# EAGLE design knowles_mic (EAGLE 7.2.0)
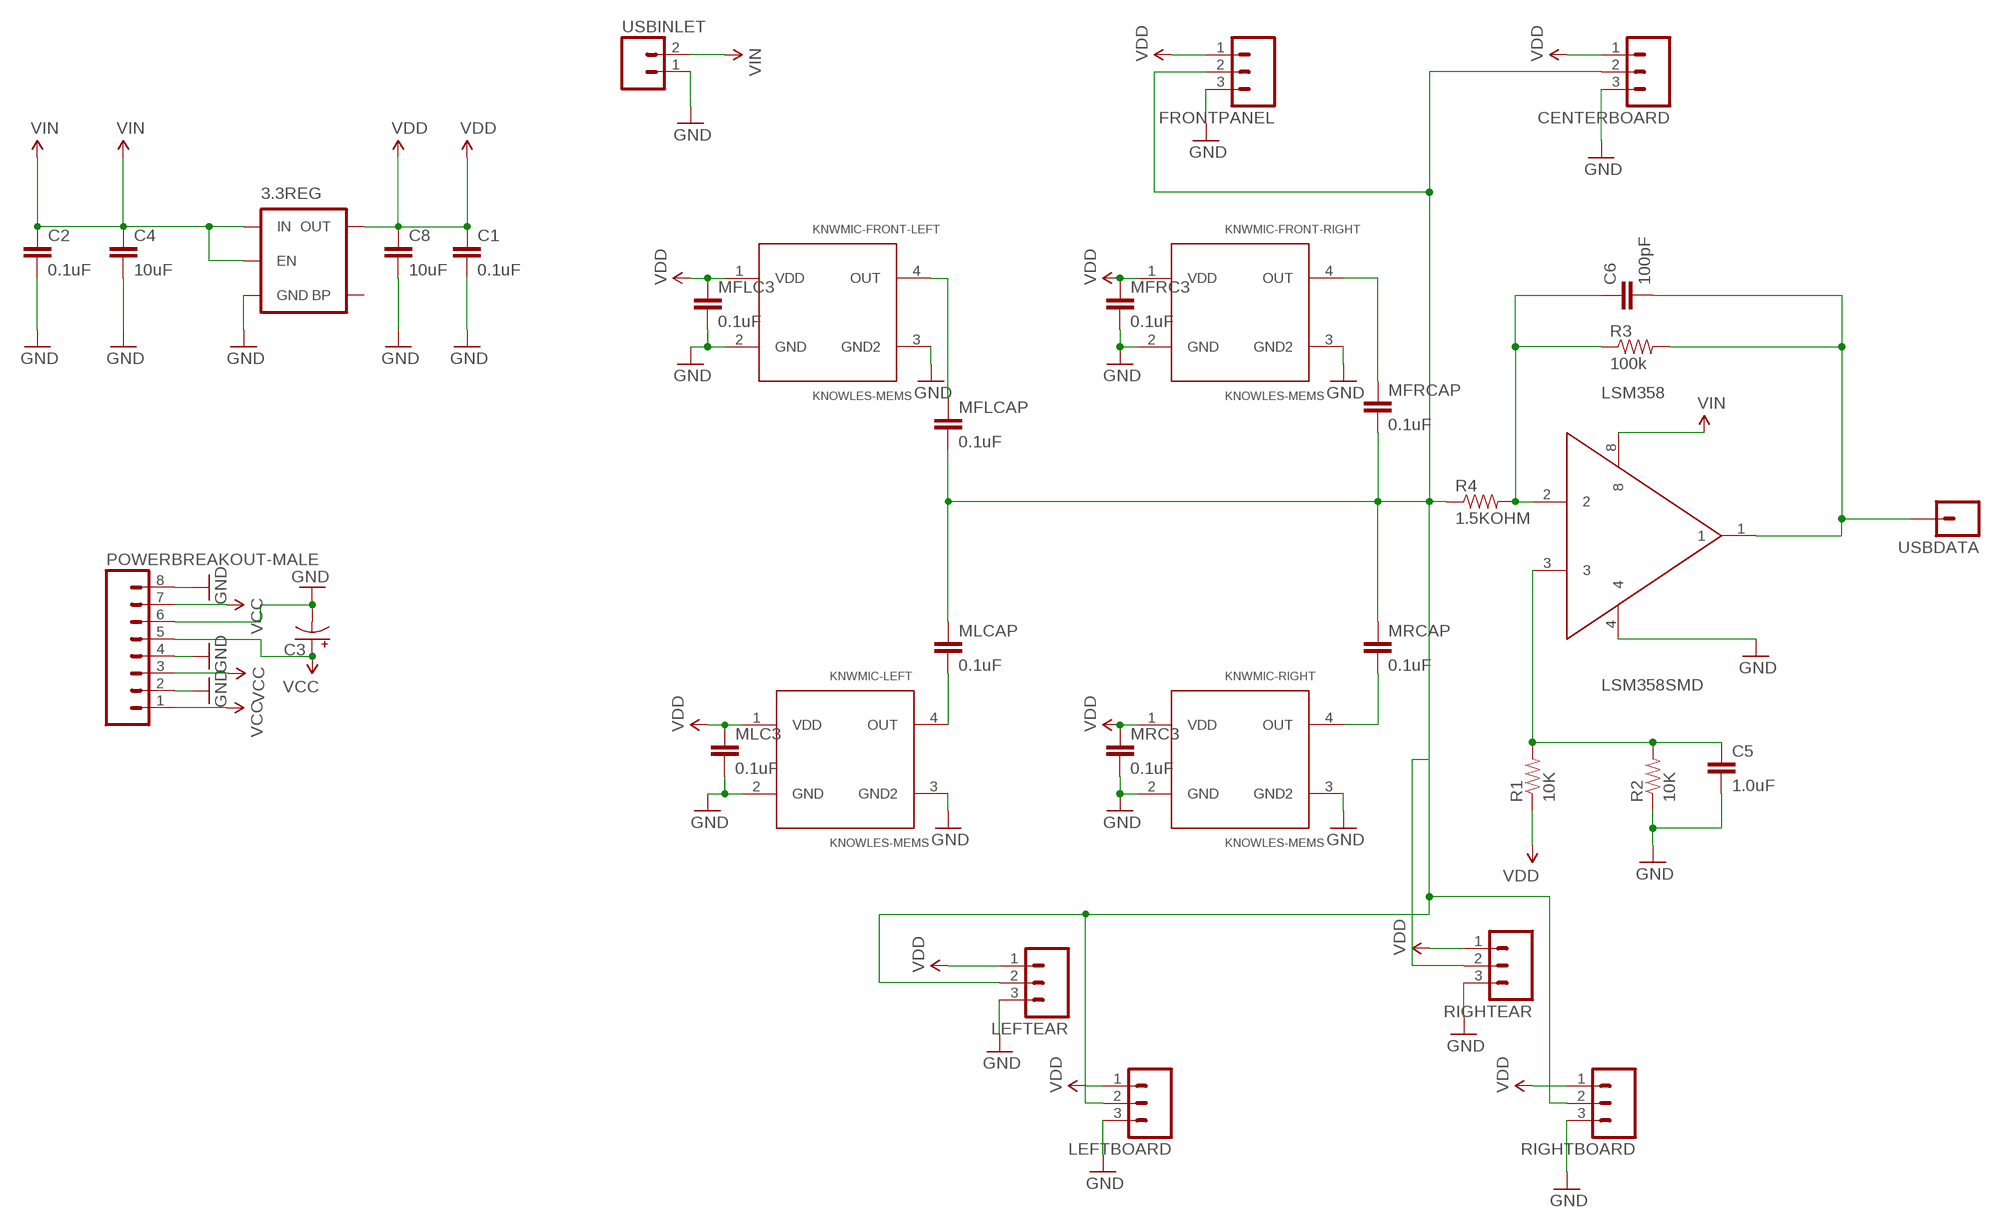
[diagram p0: schematic, sheet 1]

## Parts
3.3REG  MIC52053.3V  [SOT23-5]
C1  0.1uF  0.1UF-25V-5%(0603)  [0603-CAP]
C2  0.1uF  0.1UF-25V-5%(0603)  [0603-CAP]
C3  CAP_POLG  [PANASONIC_G]
C4  10uF  10UF-6.3V-20%(0603)  [0603-CAP]
C5  1.0uF  1.0UF-16V-10%(0603)  [0603-CAP]
C6  100pF  100PF-50V-5%(0603)  [0603-CAP]
C8  10uF  10UF-6.3V-20%(0603)  [0603-CAP]
CENTERBOARD  M03PTH  [1X03]
FRONTPANEL  M03PTH  [1X03]
KNWMIC-FRONT-LEFT  KNOWLES-MEMS  [MEMS-SPU0410]
KNWMIC-FRONT-RIGHT  KNOWLES-MEMS  [MEMS-SPU0410]
KNWMIC-LEFT  KNOWLES-MEMS  [MEMS-SPU0410]
KNWMIC-RIGHT  KNOWLES-MEMS  [MEMS-SPU0410]
LEFTBOARD  M03PTH  [1X03]
LEFTEAR  M03PTH  [1X03]
LSM358  LSM358SMD  [SOP-8L]
MFLC3  0.1uF  0.1UF-25V-5%(0603)  [0603-CAP]
MFLCAP  0.1uF  0.1UF-25V-5%(0603)  [0603-CAP]
MFRC3  0.1uF  0.1UF-25V-5%(0603)  [0603-CAP]
MFRCAP  0.1uF  0.1UF-25V-5%(0603)  [0603-CAP]
MLC3  0.1uF  0.1UF-25V-5%(0603)  [0603-CAP]
MLCAP  0.1uF  0.1UF-25V-5%(0603)  [0603-CAP]
MRC3  0.1uF  0.1UF-25V-5%(0603)  [0603-CAP]
MRCAP  0.1uF  0.1UF-25V-5%(0603)  [0603-CAP]
POWERBREAKOUT-MALE  M08SMD-STRAIGHT-FEMALE  [1X08_SMD]
R1  10K  10KOHM-1/10W-1%(0603)0603  [0603-RES]
R2  10K  10KOHM-1/10W-1%(0603)0603  [0603-RES]
R3  100k  100KOHM-1/10W-1%(0603)  [0603-RES]
R4  1.5KOHM  1.5KOHM-1/10W-1%(0603)  [0603]
RIGHTBOARD  M03PTH  [1X03]
RIGHTEAR  M03PTH  [1X03]
USBDATA  M01PTH  [1X01]
USBINLET  M02PTH  [1X02]

## Nets
GND: 3.3REG.2(GND) C1.2 C2.2 C3.- C4.2 C5.2 C8.2 CENTERBOARD.3 FRONTPANEL.3 KNWMIC-FRONT-LEFT.2(GND) KNWMIC-FRONT-LEFT.3(GND2) KNWMIC-FRONT-RIGHT.2(GND) KNWMIC-FRONT-RIGHT.3(GND2) KNWMIC-LEFT.2(GND) KNWMIC-LEFT.3(GND2) KNWMIC-RIGHT.2(GND) KNWMIC-RIGHT.3(GND2) LEFTBOARD.3 LEFTEAR.3 LSM358.4 MFLC3.2 MFRC3.2 MLC3.2 MRC3.2 POWERBREAKOUT-MALE.2 POWERBREAKOUT-MALE.4 POWERBREAKOUT-MALE.6 POWERBREAKOUT-MALE.8 R2.1 RIGHTBOARD.3 RIGHTEAR.3 USBINLET.1
N$1: CENTERBOARD.2 FRONTPANEL.2 LEFTBOARD.2 LEFTEAR.2 MFLCAP.2 MFRCAP.2 MLCAP.1 MRCAP.1 R4.1 RIGHTBOARD.2 RIGHTEAR.2
N$2: KNWMIC-RIGHT.4(OUT) MRCAP.2
N$3: KNWMIC-FRONT-LEFT.4(OUT) MFLCAP.1
N$5: KNWMIC-LEFT.4(OUT) MLCAP.2
N$7: C5.1 LSM358.3 R1.2 R2.2
N$8: KNWMIC-FRONT-RIGHT.4(OUT) MFRCAP.1
N$9: C6.1 LSM358.2 R3.1 R4.2
N$10: C6.2 LSM358.1 R3.2 USBDATA.1
VCC: C3.+ POWERBREAKOUT-MALE.1 POWERBREAKOUT-MALE.3 POWERBREAKOUT-MALE.5 POWERBREAKOUT-MALE.7
VDD: 3.3REG.5(OUT) C1.1 C8.1 CENTERBOARD.1 FRONTPANEL.1 KNWMIC-FRONT-LEFT.1(VDD) KNWMIC-FRONT-RIGHT.1(VDD) KNWMIC-LEFT.1(VDD) KNWMIC-RIGHT.1(VDD) LEFTBOARD.1 LEFTEAR.1 MFLC3.1 MFRC3.1 MLC3.1 MRC3.1 R1.1 RIGHTBOARD.1 RIGHTEAR.1
VIN: 3.3REG.1(IN) 3.3REG.3(EN) C2.1 C4.1 LSM358.8 USBINLET.2
Unconnected: 3.3REG.4(BP)

## Library data of the parts
3.3REG = SparkFun-PowerIC:MIC5205: MIC5205 150mA vreg 3.3V - VREG-00822 5V - VREG-00823; PROD_ID: VREG-00822
C1 C2 MFLC3 MFLCAP MFRC3 MFRCAP MLC3 MLCAP MRC3 MRCAP = SparkFun-Capacitors:0.1UF-25V-5%(0603): CAP-08604; PROD_ID: CAP-08604
C3 = SparkFun-Capacitors:CAP_POL: Capacitor Polarized These are standard SMD and PTH capacitors. Normally 10uF, 47uF, and 100uF in electrolytic and tantalum varieties. Always verify the external diameter of the through hole cap, it varies with capacity, voltage, and manufacturer. The EIA devices should be standard.
C4 C8 = SparkFun-Capacitors:10UF-6.3V-20%(0603): CAP-11015; PROD_ID: CAP-11015
C5 = SparkFun-Capacitors:1.0UF-16V-10%(0603): CAP-00868; PROD_ID: CAP-00868
C6 = SparkFun-Capacitors:100PF-50V-5%(0603): CAP-07883; PROD_ID: CAP-07883
CENTERBOARD FRONTPANEL LEFTBOARD LEFTEAR RIGHTBOARD RIGHTEAR = SparkFun-Connectors:M03: Header 3 Standard 3-pin 0.1" header. Use with straight break away headers (SKU : PRT-00116), right angle break away headers (PRT-00553), swiss pins (PRT-00743), machine pins (PRT-00117), and female headers (PRT-00115). Molex polarized connector foot print use with SKU : PRT-08232 with associated crimp pins and housings.
KNWMIC-FRONT-LEFT KNWMIC-FRONT-RIGHT KNWMIC-LEFT KNWMIC-RIGHT = abhishek:KNOWLES-MEMS
LSM358 = abhishek:LSM358
POWERBREAKOUT-MALE = SparkFun-Connectors:M08: Header 8 Standard 8-pin 0.1" header. Use with straight break away headers (SKU : PRT-00116), right angle break away headers (PRT-00553), swiss pins (PRT-00743), machine pins (PRT-00117), and female headers (PRT-00115).; PROD_ID: CONN-10204
R1 R2 = SparkFun-Resistors:10KOHM-1/10W-1%(0603): RES-00824; PROD_ID: RES-00824
R3 = SparkFun-Resistors:100KOHM-1/10W-1%(0603): RES-07828; PROD_ID: RES-07828
R4 = SparkFun-Resistors:1.5KOHM-1/10W-1%(0603): RES-08306; PROD_ID: RES-08306
USBDATA = SparkFun-Connectors:M01: Header 1 Standard 1-pin 0.1" header. Use with straight break away headers (SKU : PRT-00116), right angle break away headers (PRT-00553), swiss pins (PRT-00743), machine pins (PRT-00117), and female headers (PRT-00115). SMTSO-256-ET is a "flush mount" nut for a 4-40 screw. The older package used to be too tight, and did not allow it to sit properly thru the drill hit. The latest (0.165DIA) fits nice and snug.
USBINLET = SparkFun-Connectors:M02: Standard 2-pin 0.1" header. Use with - straight break away headers ( PRT-00116) - right angle break away headers (PRT-00553) - swiss pins (PRT-00743) - machine pins (PRT-00117) - female headers (PRT-00115) Molex polarized connector foot print use with: PRT-08233 with associated crimp pins and housings. 2.54_SCREWTERM for use with PRT-10571. 3.5mm Screw Terminal footprints for PRT-08084 5mm Screw Terminal footprints for use with PRT-08432

## Board
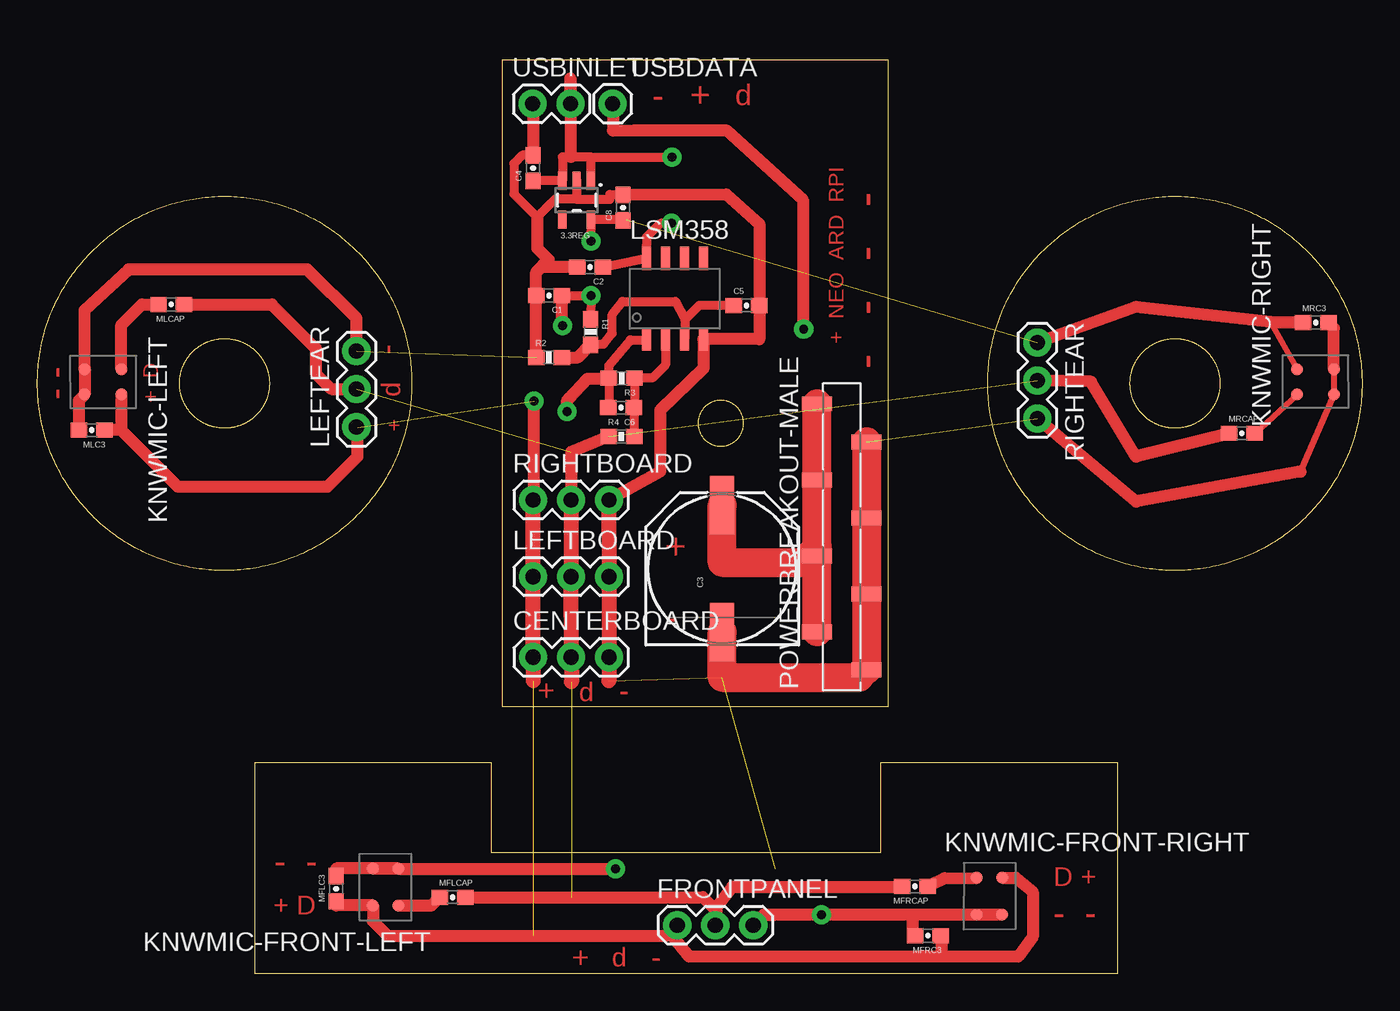
[diagram p1: board, top side]
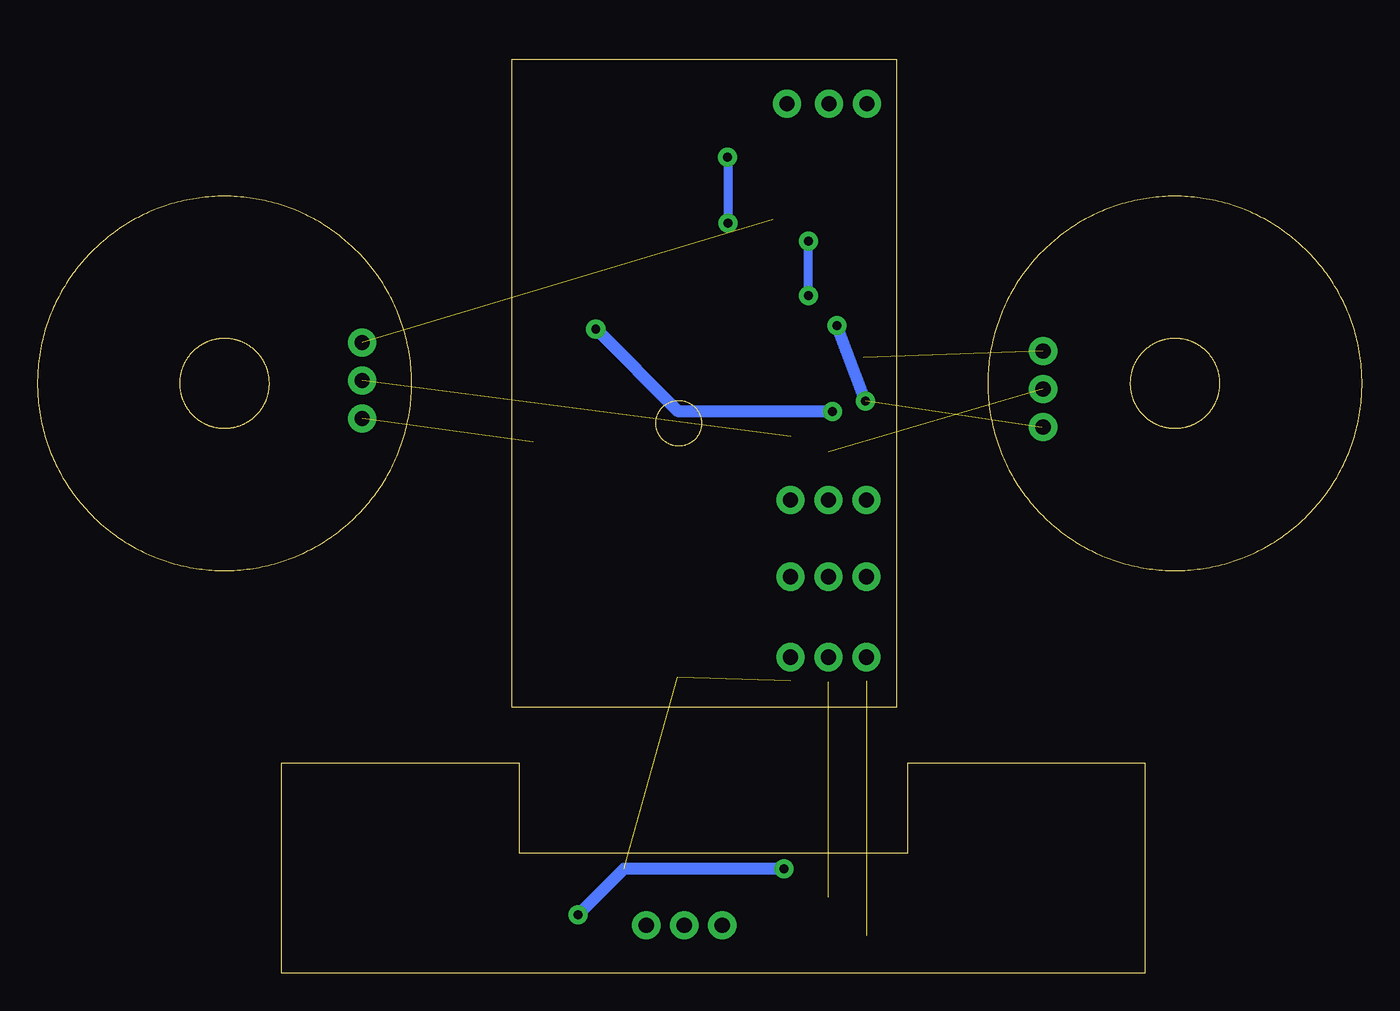
[diagram p2: board, bottom side, seen from below]

Size 88.49 x 61.04 mm. Coordinates in mm from the lower left corner, seen from the top.
Outline: 25,39.19 24.99,38.98 24.98,38.76 24.97,38.55 24.96,38.34 24.94,38.13 24.91,37.92 24.89,37.71 24.86,37.5 24.82,37.3 24.79,37.09 24.75,36.89 24.7,36.68 24.66,36.48 24.61,36.28 24.55,36.08 24.5,35.89 24.44,35.69 24.38,35.49 24.31,35.3 24.24,35.11 24.17,34.92 24.1,34.73 24.02,34.54 23.94,34.35 23.85,34.17 23.77,33.99 23.68,33.81 23.59,33.63 23.49,33.45 23.39,33.27 23.29,33.1 23.19,32.93 23.09,32.75 22.98,32.58 22.86,32.42 22.75,32.25 22.64,32.09 22.52,31.93 22.4,31.77 22.27,31.61 22.15,31.46 22.02,31.3 21.89,31.15 21.75,31 21.62,30.85 21.48,30.71 21.34,30.57 21.2,30.43 21.05,30.29 20.9,30.15 20.76,30.02 20.61,29.89 20.3,29.63 20.14,29.51 19.98,29.39 19.82,29.27 19.65,29.15 19.49,29.04 19.32,28.93 19.15,28.82 18.98,28.72 18.81,28.61 18.64,28.51 18.46,28.42 18.28,28.32 18.1,28.23 17.92,28.14 17.74,28.05 17.55,27.97 17.37,27.89 17.18,27.81 16.99,27.74 16.8,27.67 16.61,27.6 16.41,27.53 16.22,27.47 16.02,27.41 15.82,27.35 15.62,27.3 15.42,27.25 15.22,27.2 15.02,27.16 14.82,27.12 14.61,27.08 14.4,27.05 14.2,27.02 13.99,26.99 13.78,26.97 13.57,26.95 13.36,26.93 13.14,26.92 12.93,26.91 12.72,26.91 12.28,26.91 12.07,26.91 11.86,26.92 11.64,26.93 11.43,26.95 11.01,26.99 10.8,27.02 10.6,27.05 10.39,27.08 10.18,27.12 9.98,27.16 9.78,27.2 9.58,27.25 9.38,27.3 9.18,27.35 8.98,27.41 8.78,27.47 8.59,27.53 8.39,27.6 8.2,27.67 8.01,27.74 7.82,27.81 7.45,27.97 7.26,28.05 7.08,28.14 6.9,28.23 6.72,28.32 6.54,28.42 6.36,28.51 6.19,28.61 6.02,28.72 5.85,28.82 5.68,28.93 5.51,29.04 5.34,29.15 5.18,29.27 5.02,29.39 4.86,29.51 4.7,29.63 4.39,29.89 4.24,30.02 4.1,30.15 3.95,30.29 3.8,30.43 3.66,30.57 3.52,30.71 3.38,30.85 3.25,31 3.11,31.15 2.98,31.3 2.85,31.46 2.73,31.61 2.6,31.77 2.48,31.93 2.36,32.09 2.25,32.25 2.13,32.42 2.02,32.58 1.91,32.75 1.81,32.93 1.7,33.1 1.6,33.27 1.51,33.45 1.41,33.63 1.32,33.81 1.23,33.99 1.14,34.17 1.06,34.35 0.98,34.54 0.9,34.73 0.83,34.92 0.76,35.11 0.69,35.3 0.62,35.49 0.56,35.69 0.5,35.89 0.44,36.08 0.39,36.28 0.34,36.48 0.3,36.68 0.25,36.89 0.21,37.09 0.18,37.3 0.14,37.5 0.11,37.71 0.09,37.92 0.06,38.13 0.04,38.34 0.03,38.55 0.02,38.76 0.01,38.98 0,39.19 0,39.62 0.01,39.84 0.02,40.05 0.03,40.26 0.04,40.48 0.06,40.69 0.09,40.9 0.11,41.1 0.14,41.31 0.18,41.52 0.21,41.72 0.25,41.93 0.3,42.13 0.34,42.33 0.39,42.53 0.44,42.73 0.5,42.93 0.56,43.12 0.62,43.32 0.69,43.51 0.76,43.7 0.83,43.9 0.9,44.09 0.98,44.27 1.06,44.46 1.14,44.64 1.23,44.83 1.32,45.01 1.41,45.19 1.51,45.37 1.6,45.54 1.7,45.72 1.81,45.89 1.91,46.06 2.02,46.23 2.13,46.4 2.25,46.56 2.36,46.73 2.48,46.89 2.6,47.05 2.73,47.2 2.85,47.36 2.98,47.51 3.11,47.66 3.25,47.81 3.38,47.96 3.52,48.1 3.8,48.39 3.95,48.53 4.24,48.79 4.39,48.93 4.7,49.18 4.86,49.3 5.02,49.42 5.18,49.54 5.34,49.66 5.51,49.77 5.68,49.88 5.85,49.99 6.02,50.1 6.19,50.2 6.36,50.3 6.54,50.4 6.72,50.49 6.9,50.59 7.08,50.67 7.26,50.76 7.45,50.85 7.82,51 8.01,51.08 8.2,51.15 8.39,51.22 8.59,51.28 8.78,51.35 8.98,51.41 9.18,51.46 9.38,51.51 9.58,51.57 9.78,51.61 9.98,51.65 10.18,51.7 10.39,51.73 10.6,51.76 10.8,51.8 11.01,51.82 11.22,51.84 11.43,51.86 11.64,51.88 11.86,51.89 12.07,51.9 12.28,51.91 12.72,51.91 12.93,51.9 13.14,51.89 13.36,51.88 13.57,51.86 13.78,51.84 13.99,51.82 14.2,51.8 14.4,51.76 14.61,51.73 14.82,51.7 15.22,51.61 15.42,51.57 15.62,51.51 15.82,51.46 16.02,51.41 16.22,51.35 16.41,51.28 16.61,51.22 16.8,51.15 16.99,51.08 17.18,51 17.37,50.92 17.55,50.85 17.74,50.76 17.92,50.67 18.1,50.59 18.28,50.49 18.46,50.4 18.64,50.3 18.81,50.2 18.98,50.1 19.15,49.99 19.32,49.88 19.49,49.77 19.65,49.66 19.82,49.54 19.98,49.42 20.14,49.3 20.3,49.18 20.61,48.93 20.76,48.79 20.9,48.66 21.05,48.53 21.2,48.39 21.34,48.25 21.48,48.1 21.62,47.96 21.75,47.81 21.89,47.66 22.02,47.51 22.15,47.36 22.27,47.2 22.4,47.05 22.52,46.89 22.64,46.73 22.75,46.56 22.86,46.4 22.98,46.23 23.09,46.06 23.29,45.72 23.39,45.54 23.49,45.37 23.59,45.19 23.68,45.01 23.77,44.83 23.85,44.64 23.94,44.46 24.02,44.27 24.1,44.09 24.17,43.9 24.24,43.7 24.31,43.51 24.38,43.32 24.44,43.12 24.5,42.93 24.55,42.73 24.61,42.53 24.66,42.33 24.7,42.13 24.75,41.93 24.79,41.72 24.82,41.52 24.86,41.31 24.89,41.1 24.91,40.9 24.94,40.69 24.96,40.48 24.97,40.26 24.98,40.05 24.99,39.84 25,39.62 25,39.19
Outline: 15.5,39.36 15.5,39.3 15.5,39.25 15.49,39.2 15.49,39.15 15.48,39.1 15.48,39.05 15.47,39 15.46,38.9 15.45,38.85 15.44,38.8 15.43,38.75 15.42,38.71 15.41,38.66 15.39,38.61 15.38,38.56 15.35,38.47 15.33,38.42 15.32,38.38 15.3,38.33 15.28,38.28 15.26,38.24 15.25,38.19 15.23,38.15 15.2,38.11 15.18,38.06 15.16,38.02 15.14,37.98 15.11,37.93 15.09,37.89 15.07,37.85 15.04,37.81 15.01,37.77 14.96,37.69 14.93,37.65 14.9,37.61 14.88,37.57 14.85,37.54 14.78,37.46 14.75,37.43 14.72,37.39 14.69,37.35 14.66,37.32 14.62,37.29 14.59,37.25 14.55,37.22 14.52,37.19 14.48,37.15 14.45,37.12 14.37,37.06 14.33,37.03 14.29,37 14.26,36.97 14.22,36.95 14.14,36.89 14.1,36.87 14.06,36.84 14.01,36.82 13.97,36.79 13.93,36.77 13.89,36.75 13.84,36.72 13.8,36.7 13.76,36.68 13.71,36.66 13.67,36.64 13.62,36.62 13.58,36.61 13.53,36.59 13.49,36.57 13.44,36.56 13.39,36.54 13.35,36.53 13.3,36.51 13.25,36.5 13.2,36.49 13.15,36.48 13.1,36.47 13.06,36.46 13.01,36.45 12.96,36.44 12.91,36.43 12.86,36.43 12.81,36.42 12.76,36.42 12.71,36.41 12.65,36.41 12.6,36.41 12.55,36.41 12.45,36.41 12.4,36.41 12.35,36.41 12.29,36.41 12.24,36.42 12.19,36.42 12.14,36.43 12.09,36.43 12.04,36.44 11.99,36.45 11.94,36.46 11.85,36.48 11.8,36.49 11.75,36.5 11.7,36.51 11.65,36.53 11.61,36.54 11.56,36.56 11.51,36.57 11.47,36.59 11.42,36.61 11.38,36.62 11.33,36.64 11.29,36.66 11.24,36.68 11.2,36.7 11.16,36.72 11.11,36.75 11.07,36.77 11.03,36.79 10.99,36.82 10.94,36.84 10.9,36.87 10.86,36.89 10.78,36.95 10.74,36.97 10.7,37 10.67,37.03 10.63,37.06 10.55,37.12 10.52,37.15 10.48,37.19 10.45,37.22 10.41,37.25 10.34,37.32 10.31,37.35 10.28,37.39 10.25,37.43 10.22,37.46 10.18,37.5 10.15,37.54 10.12,37.57 10.1,37.61 10.07,37.65 10.04,37.69 9.98,37.77 9.96,37.81 9.93,37.85 9.91,37.89 9.88,37.93 9.86,37.98 9.84,38.02 9.82,38.06 9.8,38.11 9.77,38.15 9.75,38.19 9.74,38.24 9.72,38.28 9.7,38.33 9.68,38.38 9.66,38.42 9.65,38.47 9.63,38.52 9.62,38.56 9.61,38.61 9.59,38.66 9.58,38.71 9.57,38.75 9.56,38.8 9.55,38.85 9.54,38.9 9.53,38.95 9.53,39 9.52,39.05 9.51,39.15 9.51,39.2 9.5,39.25 9.5,39.3 9.5,39.36 9.5,39.46 9.5,39.51 9.51,39.61 9.51,39.66 9.52,39.71 9.52,39.76 9.53,39.81 9.53,39.86 9.54,39.91 9.55,39.96 9.56,40.01 9.57,40.06 9.58,40.11 9.59,40.16 9.61,40.21 9.62,40.25 9.63,40.3 9.65,40.35 9.66,40.39 9.68,40.44 9.7,40.49 9.72,40.53 9.74,40.58 9.75,40.62 9.77,40.66 9.8,40.71 9.82,40.75 9.84,40.79 9.86,40.84 9.88,40.88 9.91,40.92 9.93,40.96 9.96,41 9.98,41.04 10.01,41.08 10.04,41.12 10.07,41.16 10.1,41.2 10.12,41.24 10.15,41.28 10.18,41.32 10.22,41.35 10.25,41.39 10.28,41.42 10.31,41.46 10.34,41.49 10.38,41.53 10.41,41.56 10.45,41.6 10.48,41.63 10.52,41.66 10.55,41.69 10.59,41.72 10.63,41.75 10.67,41.78 10.7,41.81 10.74,41.84 10.78,41.87 10.82,41.89 10.86,41.92 10.9,41.95 10.94,41.97 10.99,42 11.03,42.02 11.07,42.05 11.11,42.07 11.16,42.09 11.2,42.11 11.24,42.13 11.29,42.15 11.33,42.17 11.38,42.19 11.42,42.21 11.47,42.23 11.51,42.24 11.56,42.26 11.61,42.27 11.65,42.29 11.7,42.3 11.75,42.31 11.8,42.33 11.85,42.34 11.94,42.36 11.99,42.37 12.04,42.37 12.09,42.38 12.14,42.39 12.19,42.39 12.24,42.4 12.29,42.4 12.35,42.4 12.4,42.41 12.45,42.41 12.55,42.41 12.6,42.41 12.65,42.4 12.71,42.4 12.76,42.4 12.81,42.39 12.86,42.39 12.91,42.38 12.96,42.37 13.01,42.37 13.06,42.36 13.1,42.35 13.15,42.34 13.2,42.33 13.25,42.31 13.3,42.3 13.35,42.29 13.39,42.27 13.44,42.26 13.49,42.24 13.53,42.23 13.58,42.21 13.62,42.19 13.67,42.17 13.71,42.15 13.76,42.13 13.8,42.11 13.84,42.09 13.89,42.07 13.93,42.05 13.97,42.02 14.01,42 14.06,41.97 14.1,41.95 14.14,41.92 14.18,41.89 14.22,41.87 14.26,41.84 14.29,41.81 14.33,41.78 14.37,41.75 14.41,41.72 14.45,41.69 14.48,41.66 14.52,41.63 14.55,41.6 14.59,41.56 14.62,41.53 14.66,41.49 14.69,41.46 14.72,41.42 14.75,41.39 14.78,41.35 14.85,41.28 14.88,41.24 14.9,41.2 14.93,41.16 14.96,41.12 14.99,41.08 15.01,41.04 15.04,41 15.07,40.96 15.09,40.92 15.11,40.88 15.14,40.84 15.16,40.79 15.18,40.75 15.2,40.71 15.23,40.66 15.25,40.62 15.26,40.58 15.28,40.53 15.3,40.49 15.32,40.44 15.33,40.39 15.35,40.35 15.37,40.3 15.38,40.25 15.39,40.21 15.41,40.16 15.42,40.11 15.43,40.06 15.44,40.01 15.45,39.96 15.46,39.91 15.47,39.81 15.48,39.76 15.48,39.71 15.49,39.66 15.49,39.61 15.5,39.56 15.5,39.51 15.5,39.46 15.5,39.36
Outline: 88.49,39.19 88.49,38.98 88.48,38.76 88.47,38.55 88.45,38.34 88.43,38.13 88.41,37.92 88.38,37.71 88.35,37.5 88.32,37.3 88.28,37.09 88.24,36.89 88.2,36.68 88.15,36.48 88.1,36.28 88.05,36.08 87.99,35.89 87.93,35.69 87.87,35.49 87.8,35.3 87.73,35.11 87.66,34.92 87.59,34.73 87.51,34.54 87.43,34.35 87.35,34.17 87.26,33.99 87.17,33.81 87.08,33.63 86.98,33.45 86.89,33.27 86.79,33.1 86.68,32.93 86.58,32.75 86.47,32.58 86.36,32.42 86.25,32.25 86.13,32.09 86.01,31.93 85.89,31.77 85.77,31.61 85.64,31.46 85.51,31.3 85.38,31.15 85.25,31 85.11,30.85 84.97,30.71 84.83,30.57 84.69,30.43 84.55,30.29 84.4,30.15 84.25,30.02 84.1,29.89 83.94,29.76 83.79,29.63 83.63,29.51 83.47,29.39 83.31,29.27 83.15,29.15 82.98,29.04 82.82,28.93 82.65,28.82 82.47,28.72 82.3,28.61 82.13,28.51 81.95,28.42 81.77,28.32 81.59,28.23 81.41,28.14 81.23,28.05 81.05,27.97 80.67,27.81 80.48,27.74 80.29,27.67 80.1,27.6 79.91,27.53 79.71,27.47 79.51,27.41 79.32,27.35 79.12,27.3 78.92,27.25 78.72,27.2 78.51,27.16 78.31,27.12 78.1,27.08 77.9,27.05 77.69,27.02 77.48,26.99 77.06,26.95 76.85,26.93 76.64,26.92 76.42,26.91 76.21,26.91 75.78,26.91 75.56,26.91 75.35,26.92 75.14,26.93 74.93,26.95 74.72,26.97 74.51,26.99 74.3,27.02 74.09,27.05 73.88,27.08 73.68,27.12 73.47,27.16 73.27,27.2 73.07,27.25 72.87,27.3 72.67,27.35 72.47,27.41 72.28,27.47 72.08,27.53 71.89,27.6 71.7,27.67 71.5,27.74 71.31,27.81 70.94,27.97 70.76,28.05 70.57,28.14 70.39,28.23 70.21,28.32 70.03,28.42 69.86,28.51 69.68,28.61 69.51,28.72 69.34,28.82 69.17,28.93 69,29.04 68.84,29.15 68.67,29.27 68.51,29.39 68.35,29.51 68.2,29.63 67.89,29.89 67.74,30.02 67.59,30.15 67.44,30.29 67.3,30.43 67.15,30.57 67.01,30.71 66.87,30.85 66.74,31 66.61,31.15 66.47,31.3 66.35,31.46 66.22,31.61 66.1,31.77 65.98,31.93 65.86,32.09 65.74,32.25 65.63,32.42 65.52,32.58 65.41,32.75 65.3,32.93 65.2,33.1 65.1,33.27 65,33.45 64.91,33.63 64.81,33.81 64.73,33.99 64.64,34.17 64.55,34.35 64.48,34.54 64.4,34.73 64.32,34.92 64.25,35.11 64.18,35.3 64.12,35.49 64.06,35.69 63.99,35.89 63.94,36.08 63.89,36.28 63.84,36.48 63.79,36.68 63.75,36.89 63.71,37.09 63.67,37.3 63.64,37.5 63.61,37.71 63.58,37.92 63.56,38.13 63.54,38.34 63.52,38.55 63.51,38.76 63.5,38.98 63.49,39.19 63.49,39.62 63.5,39.84 63.51,40.05 63.52,40.26 63.54,40.48 63.56,40.69 63.58,40.9 63.61,41.1 63.64,41.31 63.67,41.52 63.71,41.72 63.75,41.93 63.79,42.13 63.84,42.33 63.89,42.53 63.94,42.73 63.99,42.93 64.06,43.12 64.12,43.32 64.18,43.51 64.25,43.7 64.32,43.9 64.4,44.09 64.48,44.27 64.55,44.46 64.64,44.64 64.73,44.83 64.81,45.01 64.91,45.19 65,45.37 65.1,45.54 65.2,45.72 65.3,45.89 65.41,46.06 65.52,46.23 65.63,46.4 65.74,46.56 65.86,46.73 65.98,46.89 66.1,47.05 66.22,47.2 66.35,47.36 66.47,47.51 66.61,47.66 66.74,47.81 66.87,47.96 67.01,48.1 67.3,48.39 67.44,48.53 67.74,48.79 67.89,48.93 68.2,49.18 68.35,49.3 68.51,49.42 68.67,49.54 68.84,49.66 69,49.77 69.17,49.88 69.34,49.99 69.51,50.1 69.68,50.2 69.86,50.3 70.03,50.4 70.21,50.49 70.39,50.59 70.57,50.67 70.76,50.76 70.94,50.85 71.31,51 71.5,51.08 71.7,51.15 71.89,51.22 72.08,51.28 72.28,51.35 72.47,51.41 72.67,51.46 72.87,51.51 73.07,51.57 73.27,51.61 73.47,51.65 73.68,51.7 73.88,51.73 74.09,51.76 74.3,51.8 74.51,51.82 74.72,51.84 74.93,51.86 75.14,51.88 75.35,51.89 75.56,51.9 75.78,51.91 76.21,51.91 76.42,51.9 76.64,51.89 76.85,51.88 77.06,51.86 77.27,51.84 77.48,51.82 77.69,51.8 77.9,51.76 78.1,51.73 78.31,51.7 78.51,51.65 78.72,51.61 78.92,51.57 79.12,51.51 79.32,51.46 79.51,51.41 79.71,51.35 79.91,51.28 80.1,51.22 80.48,51.08 80.67,51 81.05,50.85 81.23,50.76 81.41,50.67 81.59,50.59 81.77,50.49 81.95,50.4 82.13,50.3 82.3,50.2 82.47,50.1 82.65,49.99 82.82,49.88 82.98,49.77 83.15,49.66 83.31,49.54 83.47,49.42 83.63,49.3 83.79,49.18 83.94,49.05 84.1,48.93 84.25,48.79 84.4,48.66 84.55,48.53 84.69,48.39 84.97,48.1 85.11,47.96 85.25,47.81 85.38,47.66 85.51,47.51 85.77,47.2 85.89,47.05 86.01,46.89 86.13,46.73 86.25,46.56 86.36,46.4 86.47,46.23 86.58,46.06 86.68,45.89 86.79,45.72 86.89,45.54 86.98,45.37 87.08,45.19 87.17,45.01 87.26,44.83 87.35,44.64 87.43,44.46 87.51,44.27 87.59,44.09 87.66,43.9 87.73,43.7 87.8,43.51 87.87,43.32 87.93,43.12 87.99,42.93 88.05,42.73 88.1,42.53 88.15,42.33 88.2,42.13 88.24,41.93 88.28,41.72 88.32,41.52 88.35,41.31 88.38,41.1 88.41,40.9 88.43,40.69 88.45,40.48 88.47,40.26 88.48,40.05 88.49,39.84 88.49,39.62 88.49,39.19
Outline: 78.99,39.36 78.99,39.3 78.99,39.25 78.99,39.2 78.98,39.15 78.98,39.1 78.97,39.05 78.97,39 78.96,38.95 78.95,38.9 78.94,38.85 78.93,38.8 78.92,38.75 78.91,38.71 78.9,38.66 78.89,38.61 78.87,38.56 78.86,38.52 78.84,38.47 78.83,38.42 78.81,38.38 78.79,38.33 78.78,38.28 78.76,38.24 78.74,38.19 78.72,38.15 78.7,38.11 78.68,38.06 78.65,38.02 78.63,37.98 78.61,37.93 78.58,37.89 78.56,37.85 78.53,37.81 78.51,37.77 78.45,37.69 78.43,37.65 78.4,37.61 78.37,37.57 78.34,37.54 78.31,37.5 78.28,37.46 78.25,37.43 78.18,37.35 78.15,37.32 78.08,37.25 78.05,37.22 78.01,37.19 77.97,37.15 77.94,37.12 77.86,37.06 77.83,37.03 77.79,37 77.75,36.97 77.71,36.95 77.67,36.92 77.63,36.89 77.59,36.87 77.55,36.84 77.51,36.82 77.47,36.79 77.38,36.75 77.34,36.72 77.29,36.7 77.25,36.68 77.21,36.66 77.16,36.64 77.12,36.62 77.07,36.61 77.02,36.59 76.98,36.57 76.93,36.56 76.89,36.54 76.84,36.53 76.79,36.51 76.74,36.5 76.69,36.49 76.65,36.48 76.6,36.47 76.55,36.46 76.5,36.45 76.45,36.44 76.4,36.43 76.35,36.43 76.3,36.42 76.25,36.42 76.2,36.41 76.15,36.41 76.1,36.41 76.04,36.41 75.94,36.41 75.89,36.41 75.84,36.41 75.79,36.41 75.74,36.42 75.69,36.42 75.64,36.43 75.59,36.43 75.54,36.44 75.49,36.45 75.44,36.46 75.39,36.47 75.34,36.48 75.29,36.49 75.24,36.5 75.2,36.51 75.15,36.53 75.1,36.54 75.05,36.56 75.01,36.57 74.96,36.59 74.92,36.61 74.87,36.62 74.83,36.64 74.78,36.66 74.74,36.68 74.69,36.7 74.65,36.72 74.61,36.75 74.52,36.79 74.48,36.82 74.44,36.84 74.4,36.87 74.36,36.89 74.28,36.95 74.24,36.97 74.2,37 74.16,37.03 74.12,37.06 74.05,37.12 74.01,37.15 73.98,37.19 73.94,37.22 73.91,37.25 73.84,37.32 73.8,37.35 73.77,37.39 73.74,37.43 73.71,37.46 73.68,37.5 73.65,37.54 73.62,37.57 73.59,37.61 73.56,37.65 73.53,37.69 73.48,37.77 73.45,37.81 73.43,37.85 73.4,37.89 73.38,37.93 73.36,37.98 73.33,38.02 73.31,38.06 73.29,38.11 73.27,38.15 73.25,38.19 73.23,38.24 73.21,38.28 73.19,38.33 73.18,38.38 73.16,38.42 73.14,38.47 73.13,38.52 73.11,38.56 73.1,38.61 73.09,38.66 73.08,38.71 73.06,38.75 73.05,38.8 73.04,38.85 73.04,38.9 73.02,39 73.01,39.05 73.01,39.1 73,39.15 73,39.2 73,39.25 72.99,39.3 72.99,39.36 72.99,39.46 72.99,39.51 73,39.56 73,39.61 73,39.66 73.01,39.71 73.01,39.76 73.02,39.81 73.04,39.91 73.04,39.96 73.05,40.01 73.06,40.06 73.08,40.11 73.09,40.16 73.1,40.21 73.11,40.25 73.13,40.3 73.14,40.35 73.16,40.39 73.18,40.44 73.19,40.49 73.21,40.53 73.23,40.58 73.25,40.62 73.27,40.66 73.31,40.75 73.33,40.79 73.36,40.84 73.38,40.88 73.4,40.92 73.43,40.96 73.45,41 73.48,41.04 73.51,41.08 73.53,41.12 73.56,41.16 73.59,41.2 73.62,41.24 73.65,41.28 73.68,41.32 73.71,41.35 73.74,41.39 73.77,41.42 73.8,41.46 73.84,41.49 73.87,41.53 73.91,41.56 73.94,41.6 73.98,41.63 74.01,41.66 74.05,41.69 74.09,41.72 74.12,41.75 74.16,41.78 74.2,41.81 74.24,41.84 74.28,41.87 74.32,41.89 74.36,41.92 74.4,41.95 74.44,41.97 74.48,42 74.52,42.02 74.56,42.05 74.61,42.07 74.65,42.09 74.69,42.11 74.74,42.13 74.78,42.15 74.83,42.17 74.87,42.19 74.92,42.21 74.96,42.23 75.01,42.24 75.05,42.26 75.1,42.27 75.15,42.29 75.2,42.3 75.24,42.31 75.29,42.33 75.34,42.34 75.39,42.35 75.44,42.36 75.49,42.37 75.54,42.37 75.59,42.38 75.64,42.39 75.69,42.39 75.74,42.4 75.79,42.4 75.84,42.4 75.89,42.41 75.94,42.41 76.04,42.41 76.1,42.41 76.15,42.4 76.2,42.4 76.25,42.4 76.3,42.39 76.35,42.39 76.4,42.38 76.45,42.37 76.5,42.37 76.55,42.36 76.6,42.35 76.65,42.34 76.69,42.33 76.74,42.31 76.79,42.3 76.84,42.29 76.89,42.27 76.93,42.26 76.98,42.24 77.02,42.23 77.07,42.21 77.12,42.19 77.16,42.17 77.21,42.15 77.25,42.13 77.29,42.11 77.34,42.09 77.38,42.07 77.42,42.05 77.47,42.02 77.51,42 77.55,41.97 77.59,41.95 77.63,41.92 77.67,41.89 77.71,41.87 77.75,41.84 77.79,41.81 77.83,41.78 77.86,41.75 77.9,41.72 77.94,41.69 77.97,41.66 78.01,41.63 78.05,41.6 78.08,41.56 78.11,41.53 78.15,41.49 78.18,41.46 78.21,41.42 78.25,41.39 78.28,41.35 78.31,41.32 78.34,41.28 78.37,41.24 78.4,41.2 78.43,41.16 78.45,41.12 78.48,41.08 78.51,41.04 78.53,41 78.56,40.96 78.58,40.92 78.61,40.88 78.63,40.84 78.65,40.79 78.68,40.75 78.72,40.66 78.74,40.62 78.76,40.58 78.78,40.53 78.79,40.49 78.81,40.44 78.83,40.39 78.84,40.35 78.86,40.3 78.87,40.25 78.89,40.21 78.91,40.11 78.92,40.06 78.93,40.01 78.94,39.96 78.95,39.91 78.96,39.86 78.97,39.81 78.97,39.76 78.98,39.71 78.98,39.66 78.99,39.61 78.99,39.56 78.99,39.51 78.99,39.46 78.99,39.36
Outline: 56.33,14.05 56.33,8.05 30.33,8.05 30.33,14.05 14.5,14.05 14.5,0 72.16,0 72.16,14.05 56.33,14.05
Outline: 45.6,38.26 45.55,38.26 45.49,38.26 45.44,38.25 45.39,38.24 45.29,38.22 45.25,38.21 45.2,38.2 45.15,38.18 45.1,38.16 45.06,38.14 45.01,38.13 44.97,38.1 44.92,38.08 44.88,38.06 44.84,38.03 44.8,38 44.76,37.98 44.72,37.95 44.68,37.92 44.64,37.89 44.61,37.85 44.57,37.82 44.54,37.78 44.51,37.75 44.47,37.71 44.44,37.67 44.41,37.63 44.39,37.59 44.36,37.55 44.33,37.51 44.31,37.47 44.29,37.42 44.27,37.38 44.25,37.33 44.23,37.29 44.21,37.24 44.2,37.19 44.18,37.15 44.17,37.1 44.16,37.05 44.15,37 44.14,36.95 44.13,36.9 44.13,36.85 44.13,36.79 44.13,36.69 44.13,36.64 44.13,36.58 44.14,36.53 44.15,36.48 44.17,36.38 44.18,36.34 44.2,36.29 44.21,36.24 44.23,36.19 44.25,36.15 44.27,36.1 44.29,36.06 44.31,36.01 44.33,35.97 44.36,35.93 44.39,35.89 44.41,35.85 44.44,35.81 44.47,35.77 44.51,35.73 44.54,35.7 44.57,35.66 44.61,35.63 44.64,35.6 44.68,35.56 44.72,35.53 44.76,35.5 44.8,35.48 44.84,35.45 44.88,35.42 44.92,35.4 44.97,35.38 45.01,35.36 45.06,35.34 45.1,35.32 45.15,35.3 45.2,35.29 45.25,35.27 45.29,35.26 45.39,35.24 45.44,35.23 45.49,35.22 45.55,35.22 45.6,35.22 45.7,35.22 45.76,35.22 45.81,35.22 45.86,35.23 45.91,35.24 46.01,35.26 46.06,35.27 46.1,35.29 46.15,35.3 46.2,35.32 46.24,35.34 46.29,35.36 46.33,35.38 46.38,35.4 46.42,35.42 46.46,35.45 46.5,35.48 46.54,35.5 46.58,35.53 46.66,35.6 46.69,35.63 46.73,35.66 46.76,35.7 46.8,35.73 46.83,35.77 46.86,35.81 46.89,35.85 46.91,35.89 46.94,35.93 46.97,35.97 46.99,36.01 47.01,36.06 47.04,36.1 47.07,36.19 47.09,36.24 47.11,36.29 47.12,36.34 47.13,36.38 47.14,36.43 47.15,36.48 47.16,36.53 47.17,36.58 47.17,36.64 47.18,36.69 47.18,36.79 47.17,36.85 47.17,36.9 47.16,36.95 47.15,37 47.14,37.05 47.13,37.1 47.12,37.15 47.11,37.19 47.09,37.24 47.07,37.29 47.04,37.38 47.01,37.42 46.99,37.47 46.97,37.51 46.94,37.55 46.91,37.59 46.89,37.63 46.86,37.67 46.83,37.71 46.8,37.75 46.76,37.78 46.73,37.82 46.69,37.85 46.66,37.89 46.62,37.92 46.58,37.95 46.54,37.98 46.5,38 46.46,38.03 46.42,38.06 46.38,38.08 46.33,38.1 46.29,38.13 46.24,38.14 46.2,38.16 46.15,38.18 46.1,38.2 46.06,38.21 46.01,38.22 45.91,38.24 45.86,38.25 45.81,38.26 45.76,38.26 45.7,38.26 45.6,38.26
Outline: 56.83,61.04 56.83,17.78 31.09,17.78 31.09,61.04 56.83,61.04
Copper layers (1*16): Top 0.035mm / dielectric 1.5mm / Bottom 0.035mm
Design rules "default": minimum track width 10mil, minimum drill 24mil, track to track 8mil, track to pad 8mil, pad to pad 8mil, via to via 8mil, smd to smd 8mil, copper to edge 40mil, drill to drill 8mil, minimum pad ring 10mil, minimum via ring 8mil, stop-mask expansion 4mil, vias tented up to drill 0mil, thermal gap 10mil

### Footprints (pad centres in the part's own frame; a part is rotated, then mirrored left to right if it is on the bottom)
SOT23-5 = smd 0.55 x 1.2: 1 -0.95,-1.3; 2 0,-1.3; 3 0.95,-1.3; 4 0.95,1.3; 5 -0.95,1.3
0603-CAP = smd 1.1 x 1: 1 -0.85,0; 2 0.85,0
PANASONIC_G = smd 3.9 x 1.6: + 4.25,0; - -4.25,0
1X03 = drill 1.016 pad 1.88: 1 0,0; 2 2.54,0; 3 5.08,0
MEMS-SPU0410 = smd 0.8 x 0.8: 1 0.85,1.23; 2 0.85,-1.23; 3 -0.85,-1.23; 4 -0.85,1.23
SOP-8L = smd 0.6 x 1.55: 1 -1.905,-2.7; 2 -0.635,-2.7; 3 0.635,-2.7; 4 1.905,-2.7; 5 1.905,2.7; 6 0.635,2.7; 7 -0.635,2.7; 8 -1.905,2.7
1X08_SMD = smd 1 x 2: 1 0,1.65; 2 -2.54,-1.65; 3 -5.08,1.65; 4 -7.62,-1.65; 5 -10.16,1.65; 6 -12.7,-1.65; 7 -15.24,1.65; 8 -17.78,-1.65
0603-RES = smd 1.1 x 1: 1 -0.85,0; 2 0.85,0
0603 = smd 1.1 x 1: 1 -0.85,0; 2 0.85,0
1X01 = drill 1.016 pad 1.88: 1 0,0
1X02 = drill 1.016 pad 1.88: 1 0,0; 2 2.54,0

### Placement (x,y rotation side)
3.3REG  36.02,51.65 180 top
C1  34.17,45.28 180 top
C2  36.93,47.18 180 top
C3  45.74,27.02 90 top
C4  33.11,53.79 90 top
C5  47.38,44.61 0 top
C6  39,37.78 180 top
C8  39.13,51.16 90 top
CENTERBOARD  33.1,21.11 0 top
FRONTPANEL  42.74,3.2 0 top
KNWMIC-FRONT-LEFT  23.26,5.75 180 top
KNWMIC-FRONT-RIGHT  63.6,5.14 0 top
KNWMIC-LEFT  4.38,39.51 270 top
KNWMIC-RIGHT  85.38,39.51 90 top
LEFTBOARD  33.11,26.49 0 top
LEFTEAR  21.31,36.48 90 top
LSM358  42.58,45.06 0 top
MFLC3  19.96,5.65 90 top
MFLCAP  27.73,5.07 0 top
MFRC3  59.49,2.51 180 top
MFRCAP  58.63,5.8 180 top
MLC3  3.63,36.28 180 top
MLCAP  8.95,44.68 180 top
MRC3  85.39,43.46 0 top
MRCAP  80.47,36.07 0 top
POWERBREAKOUT-MALE  53.74,38.04 90 top
R1  36.96,42.84 270 top
R2  34.17,41.14 0 top
R3  39.03,39.75 180 top
R4  39.01,35.85 0 top
RIGHTBOARD  33.11,31.62 0 top
RIGHTEAR  66.8,42.14 270 top
USBDATA  38.42,58.09 0 top
USBINLET  33.07,58.09 0 top

### Tracks (layer width: path | path; a pad name or v marks a point on that pad's centre or on a via)
GND  (via drill 0.6 pad 1.27)  (4 unrouted)
  Top 0.406: KNWMIC-RIGHT.2 KNWMIC-RIGHT.3 84.38,33.51 | 58.61,3.89 58.5,3.9
  Top 0.61: 3.3REG.2 36.02,51.7 | 36.02,51.7 38.25,51.7 38.25,52.03 C8.2 | 36.02,51.7 34.57,51.7 33.38,50.51 31.84,52.05 31.84,54.09 32.39,54.64 C4.2 | 48.25,44.59 C5.2 | 35.8,47.18 C2.2
  Top 0.813: 84.38,33.51 73.38,31.51 RIGHTEAR.3 | LEFTEAR.3 21.31,43.74 18.03,47.02 6.08,47.02 3.14,44.27 3.14,40.54 KNWMIC-LEFT.3 KNWMIC-LEFT.2 2.78,38.29 MLC3.2 | 48.52,3.9 v52.38,3.9 58.5,3.9 58.5,2.51 MFRC3.2 | 48.52,3.9 FRONTPANEL.3 | 48.52,3.9 49.23,3.89 | KNWMIC-FRONT-LEFT.3 19.96,6.99 MFLC3.2 | KNWMIC-FRONT-LEFT.3 KNWMIC-FRONT-LEFT.2 | KNWMIC-FRONT-LEFT.3 v38.63,6.98 | KNWMIC-FRONT-RIGHT.2 KNWMIC-FRONT-RIGHT.3 58.56,3.9 58.61,3.89 | 38.14,31.85 RIGHTBOARD.3 41.61,33.52 41.61,37.61 44.49,40.38 LSM358.4 48.23,42.36 C5.2 48.22,50.06 46.01,52.04 C8.2 | USBINLET.1 33.11,58.05 C4.2 | KNWMIC-RIGHT.2 86.61,43.09 MRC3.2 | R2.1 C1.2 33.32,46.82 34.16,47.66 | 34.16,47.66 33.68,47.2 35.96,47.2 C2.2 | 33.38,50.51 33.38,48.44 34.16,47.66
  Top 1.016: 38.14,31.85 LEFTBOARD.3 38.17,25.71 CENTERBOARD.3 38.18,19.53
  Top 1.778: 54.9,19.77 POWERBREAKOUT-MALE.8
  Top 1.93: C3.- 45.74,19.77 54.9,19.77 | POWERBREAKOUT-MALE.2 POWERBREAKOUT-MALE.4 POWERBREAKOUT-MALE.6 POWERBREAKOUT-MALE.8
  Bottom 0.813: v38.63,6.98 49.3,6.98 v52.38,3.9
N$1  (3 unrouted)
  Top 0.813: MRCAP.1 73.38,34.51 70.38,39.51 RIGHTEAR.2 | MLCAP.1 15.65,44.68 18.6,41.73 18.6,40.07 19.63,39.04 21.29,39.04 LEFTEAR.2 | MFLCAP.2 44.46,5.07 45.34,4.19 | MFRCAP.2 57.78,5.78 46.42,5.78 45.34,4.37 45.34,4.19 | 45.34,3.55 45.34,3.26 FRONTPANEL.2 | 45.34,4.19 45.34,3.55 | 45.34,3.55 45.38,3.51 45.38,4.15 45.34,4.19 | R4.1 35.65,34.82 RIGHTBOARD.2 | CENTERBOARD.2 35.68,21.12 | LEFTBOARD.2 35.62,26.48
  Top 1.016: RIGHTBOARD.2 LEFTBOARD.2 | 35.62,26.48 CENTERBOARD.2 35.68,19.47
N$2
  Top 0.406: KNWMIC-RIGHT.4 MRCAP.2
N$3
  Top 0.813: MFLCAP.1 26.33,4.52 KNWMIC-FRONT-LEFT.4
N$5
  Top 0.813: KNWMIC-LEFT.4 5.61,43.31 6.97,44.67 MLCAP.2
N$7
  Top 0.61: 43.24,42.34 LSM358.3 43.25,42.4 43.25,43.66 | 43.25,43.66 42.61,44.88 39.08,44.88 38.4,44 38.4,42.75 37.81,42.03 37,42.03 | C5.1 44.2,44.61 43.25,43.66
  Top 0.813: R2.2 36.11,41.14 R1.2 37,42.03
N$8
  Top 0.813: MFRCAP.1 59.65,5.9 60.61,6.36 62.73,6.35 KNWMIC-FRONT-RIGHT.4
N$9
  Top 0.61: LSM358.2 41.95,40.64 41.08,39.77 39.9,39.77 R3.1 39.88,37.81 C6.1 R4.2
N$10  (via drill 0.6 pad 1.27)
  Top 0.61: R3.2 38.18,40.58 39.62,42.31 40.63,42.31 LSM358.1 | R3.2 | R3.2 38.18,37.81 C6.2
  Top 0.813: USBDATA.1 38.44,58.07 38.44,56.3 39.83,56.31 46.03,56.31 51.13,51.67 51.13,43.08 v51.19,43.02 | 35.45,38.33 35.51,38.39 | 35.51,38.39 36.74,39.71 38.14,39.71 R3.2 | v35.38,37.51 35.38,38.27 35.51,38.39
  Bottom 0.813: v51.19,43.02 45.74,37.57 35.44,37.57 v35.38,37.51
VCC
  Top 1.778: POWERBREAKOUT-MALE.5 52.09,28.51 51.03,27.45
  Top 1.93: C3.+ 45.74,27.45 51.03,27.45 | POWERBREAKOUT-MALE.7 POWERBREAKOUT-MALE.5 | 52.09,28.51 POWERBREAKOUT-MALE.3 POWERBREAKOUT-MALE.1
VDD  (via drill 0.6 pad 1.27)  (3 unrouted)
  Top 0.406: KNWMIC-RIGHT.1 82.38,43.51
  Top 0.61: C8.1 39.34,50.36 3.3REG.5 37,50.32 v36.99,48.92 | C1.1 v36.97,45.28 R1.1 | RIGHTBOARD.1 33.17,31.79
  Top 0.813: RIGHTEAR.1 73.38,44.51 82.38,43.51 84.49,43.51 MRC3.1 | KNWMIC-LEFT.1 5.61,36.28 | 5.61,36.28 9.38,32.51 19.38,32.51 21.38,34.51 21.38,36.41 | 21.38,36.41 LEFTEAR.1 | KNWMIC-FRONT-RIGHT.1 65.35,6.37 66.49,5.43 66.49,2.43 65.53,1.11 60.38,1.11 | 60.38,1.11 43.54,1.11 42.38,2.51 42.38,2.84 FRONTPANEL.1 42.05,2.51 23.38,2.51 22.41,3.48 KNWMIC-FRONT-LEFT.1 19.96,4.52 MFLC3.1 | 21.38,36.41 21.38,36.44 21.35,36.47 | RIGHTBOARD.1 33.11,31.87 | LEFTBOARD.1 33.08,25.98 | 33.17,31.79 v33.18,38.23 | MFRC3.1 60.38,2.51 60.38,1.11 | 5.61,36.28 MLC3.1 | v35.07,43.25 C1.1
  Top 1.016: RIGHTBOARD.1 LEFTBOARD.1 CENTERBOARD.1 33.11,19.53
  Bottom 0.61: v36.97,45.28 36.97,48.76 v36.99,48.92
  Bottom 0.813: v33.18,38.23 v35.07,43.25
VIN  (via drill 0.6 pad 1.27)
  Top 0.61: C4.1 3.3REG.3 35.07,54.52 35.63,54.52 36.97,54.52 | 36.97,54.51 36.97,54.52 | C2.1 40.67,47.77 LSM358.8 40.68,48.63 40.68,49.16 41.63,50.11 v42.36,50.11 | 36.98,54.51 36.97,54.52 | 3.3REG.1 36.97,54.51 | 36.97,54.51 v42.38,54.51
  Top 0.813: USBINLET.2 35.6,59.78 35.63,54.52
  Bottom 0.61: v42.38,54.51 42.36,54.51 v42.36,50.11

### Text on the board
Top: - | + | d | + NEO ARD RPI | - | - - - - | - - | + D | d | + | + | - | + | d | - | - - | D + | + D | - - | + | d | -